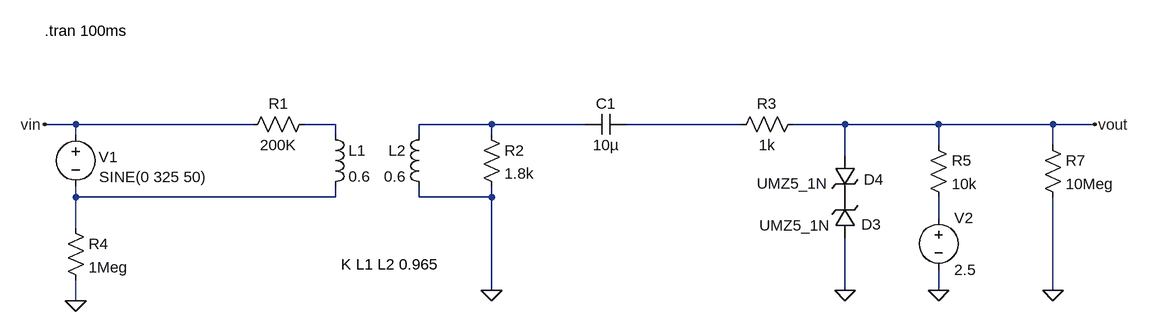
[diagram p0: schematic voltage_sim.asc]
voltage_sim.asc, the LTspice schematic file:
Version 4.1
SHEET 1 2056 880
WIRE -288 80 -336 80
WIRE -16 80 -288 80
WIRE 112 80 64 80
WIRE 352 80 240 80
WIRE 496 80 352 80
WIRE 736 80 560 80
WIRE 896 80 816 80
WIRE 1040 80 896 80
WIRE 1216 80 1040 80
WIRE 1280 80 1216 80
WIRE -288 96 -288 80
WIRE 112 96 112 80
WIRE 240 96 240 80
WIRE 352 96 352 80
WIRE 1040 112 1040 80
WIRE 1216 112 1216 80
WIRE 896 128 896 80
WIRE -288 192 -288 176
WIRE 112 192 112 176
WIRE 112 192 -288 192
WIRE 240 192 240 176
WIRE 352 192 352 176
WIRE 352 192 240 192
WIRE 1040 224 1040 192
WIRE -288 240 -288 192
WIRE 352 336 352 192
WIRE 896 336 896 256
WIRE 1040 336 1040 304
WIRE 1216 336 1216 192
WIRE -288 352 -288 320
FLAG 352 336 0
FLAG -288 352 0
FLAG 896 336 0
FLAG -336 80 vin
FLAG 1280 80 vout
FLAG 1040 336 0
FLAG 1216 336 0
SYMBOL voltage -288 80 R0
WINDOW 0 35 50 Left 2
WINDOW 3 36 81 Left 2
WINDOW 123 0 0 Left 0
WINDOW 39 0 0 Left 0
SYMATTR InstName V1
SYMATTR Value SINE(0 325 50)
SYMBOL res 336 80 R0
SYMATTR InstName R2
SYMATTR Value 1.8k
SYMBOL cap 560 64 R90
WINDOW 0 0 32 VBottom 2
WINDOW 3 32 32 VTop 2
SYMATTR InstName C1
SYMATTR Value 10µ
SYMBOL res 80 64 R90
WINDOW 0 0 56 VBottom 2
WINDOW 3 32 56 VTop 2
SYMATTR InstName R1
SYMATTR Value 200K
SYMBOL res -304 224 R0
SYMATTR InstName R4
SYMATTR Value 1Meg
SYMBOL ind 96 80 R0
SYMATTR InstName L1
SYMATTR Value 0.6
SYMATTR SpiceLine Rser=120
SYMBOL ind 256 80 M0
SYMATTR InstName L2
SYMATTR Value 0.6
SYMATTR SpiceLine Rser=120
SYMBOL zener 912 256 R180
WINDOW 0 -40 22 Left 2
WINDOW 3 38 20 Left 2
SYMATTR InstName D3
SYMATTR Value UMZ5_1N
SYMBOL zener 880 128 R0
WINDOW 3 -120 43 Left 2
WINDOW 0 45 37 Left 2
SYMATTR Value UMZ5_1N
SYMATTR InstName D4
SYMBOL res 832 64 R90
WINDOW 0 0 56 VBottom 2
WINDOW 3 32 56 VTop 2
SYMATTR InstName R3
SYMATTR Value 1k
SYMBOL res 1024 96 R0
SYMATTR InstName R5
SYMATTR Value 10k
SYMBOL voltage 1040 208 R0
WINDOW 123 0 0 Left 0
WINDOW 39 0 0 Left 0
SYMATTR InstName V2
SYMATTR Value 2.5
SYMBOL res 1200 96 R0
SYMATTR InstName R7
SYMATTR Value 10Meg
TEXT 120 296 Left 2 !K L1 L2 0.965
TEXT -336 -64 Left 2 !.tran 100ms

The netlist it stands for:
* voltage_sim.asc
V1 vin N004 SINE(0 325 50)
R2 N002 0 1.8k
C1 N003 N002 10µ
R1 N001 vin 200K
R4 N004 0 1Meg
L1 N001 N004 0.6 Rser=120
L2 N002 0 0.6 Rser=120
D3 0 P001 UMZ5_1N
D4 vout P001 UMZ5_1N
R3 vout N003 1k
R5 vout N005 10k
V2 N005 0 2.5
R7 vout 0 10Meg
.model D D
.lib standard.dio
K L1 L2 0.965
.tran 100ms
.backanno
.end